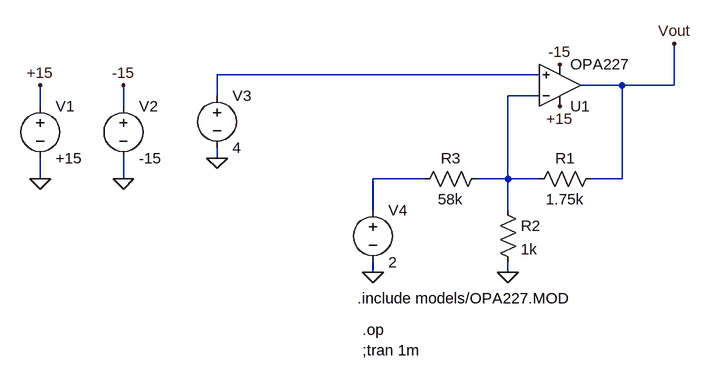
[diagram p0: schematic rotator.asc]
rotator.asc, the LTspice schematic file:
Version 4
SHEET 1 880 680
WIRE -176 -160 -672 -160
WIRE -48 -144 -112 -144
WIRE 32 -144 32 -208
WIRE 32 -144 -48 -144
WIRE -672 -128 -672 -160
WIRE -176 -128 -224 -128
WIRE -944 -112 -944 -144
WIRE -816 -112 -816 -144
WIRE -672 -32 -672 -48
WIRE -944 0 -944 -32
WIRE -816 0 -816 -32
WIRE -352 0 -432 0
WIRE -224 0 -224 -128
WIRE -224 0 -272 0
WIRE -176 0 -224 0
WIRE -48 0 -48 -144
WIRE -48 0 -96 0
WIRE -432 48 -432 0
WIRE -224 48 -224 0
WIRE -432 144 -432 128
WIRE -224 144 -224 128
FLAG -944 0 0
FLAG -816 0 0
FLAG -944 -144 +15
FLAG -816 -144 -15
FLAG -144 -112 +15
FLAG -144 -176 -15
FLAG -672 -32 0
FLAG -432 144 0
FLAG -224 144 0
FLAG 32 -208 Vout
SYMBOL voltage -944 -128 R0
WINDOW 123 0 0 Left 0
WINDOW 39 0 0 Left 0
SYMATTR InstName V1
SYMATTR Value +15
SYMBOL voltage -816 -128 R0
WINDOW 123 0 0 Left 0
WINDOW 39 0 0 Left 0
SYMATTR InstName V2
SYMATTR Value -15
SYMBOL Opamps\\opamp2 -144 -80 M180
SYMATTR InstName U1
SYMATTR Value OPA227
SYMBOL voltage -672 -144 R0
WINDOW 123 0 0 Left 0
WINDOW 39 0 0 Left 0
SYMATTR InstName V3
SYMATTR Value 4
SYMBOL voltage -432 32 R0
WINDOW 123 0 0 Left 0
WINDOW 39 0 0 Left 0
SYMATTR InstName V4
SYMATTR Value 2
SYMBOL res -192 16 R270
WINDOW 0 32 56 VTop 0
WINDOW 3 0 56 VBottom 0
SYMATTR InstName R1
SYMATTR Value 1.75k
SYMBOL res -240 32 R0
SYMATTR InstName R2
SYMATTR Value 1k
SYMBOL res -368 16 R270
WINDOW 0 32 56 VTop 0
WINDOW 3 0 56 VBottom 0
SYMATTR InstName R3
SYMATTR Value 58k
TEXT -456 184 Left 0 !.include models/OPA227.MOD
TEXT -448 232 Left 0 !.op
TEXT -448 264 Left 0 !;tran 1m

The netlist it stands for:
* rotator.asc
V1 +15 0 +15
V2 -15 0 -15
XU1 N001 N002 +15 -15 Vout OPA227  ; pins In+ In- V+ V- OUT
V3 N001 0 4
V4 N003 0 2
R1 N002 Vout 1.75k
R2 N002 0 1k
R3 N003 N002 58k
.include models/OPA227.MOD
.op
;tran 1m
.backanno
.end